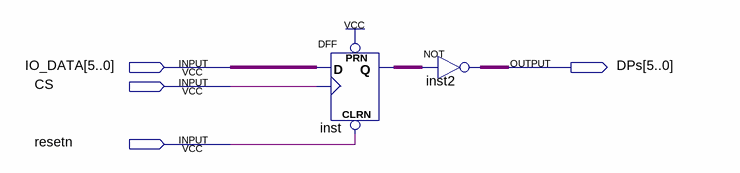
[diagram p0: schematic sheet]
// Quartus schematic Dps.bdf as structural Verilog: 2 symbols, 4 pins
module Dps (
  input  [5:0] IO_DATA,
  input  CS,
  input  resetn,
  output [5:0] DPs
);

  wire [5:0] inst_q;

  DFF inst[5:0] (.CLRN(resetn), .CLK(CS), .D(IO_DATA), .PRN(1'b1), .Q(inst_q));
  assign DPs = ~inst_q;  // NOT inst2, 6 bits wide
endmodule
